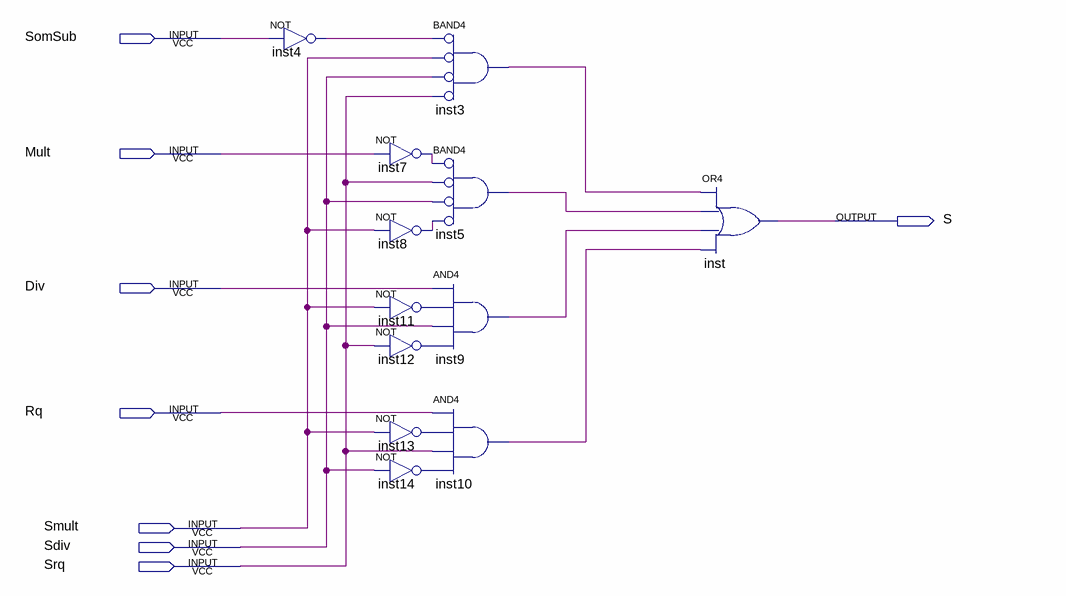
[diagram p0: schematic sheet]
// Quartus schematic multiplex2.bdf as structural Verilog: 12 symbols, 8 pins
module multiplex2 (
  input  SomSub,
  input  Mult,
  input  Div,
  input  Rq,
  input  Smult,
  input  Sdiv,
  input  Srq,
  output S
);

  wire inst3_out, inst4_out, inst5_out, inst7_out, inst8_out, inst9_out, inst10_out, inst11_out, inst12_out,
       inst13_out, inst14_out;

  not inst4 (inst4_out, SomSub);
  not inst7 (inst7_out, Mult);
  not inst8 (inst8_out, Smult);
  not inst11 (inst11_out, Smult);
  not inst12 (inst12_out, Srq);
  not inst13 (inst13_out, Smult);
  not inst14 (inst14_out, Sdiv);
  and inst3 (inst3_out, ~inst4_out, ~Smult, ~Sdiv, ~Srq);  // BAND4
  and inst5 (inst5_out, ~inst7_out, ~Srq, ~Sdiv, ~inst8_out);  // BAND4
  and inst9 (inst9_out, Div, inst11_out, Sdiv, inst12_out);
  and inst10 (inst10_out, Rq, inst13_out, Srq, inst14_out);
  or inst (S, inst3_out, inst5_out, inst9_out, inst10_out);
endmodule
